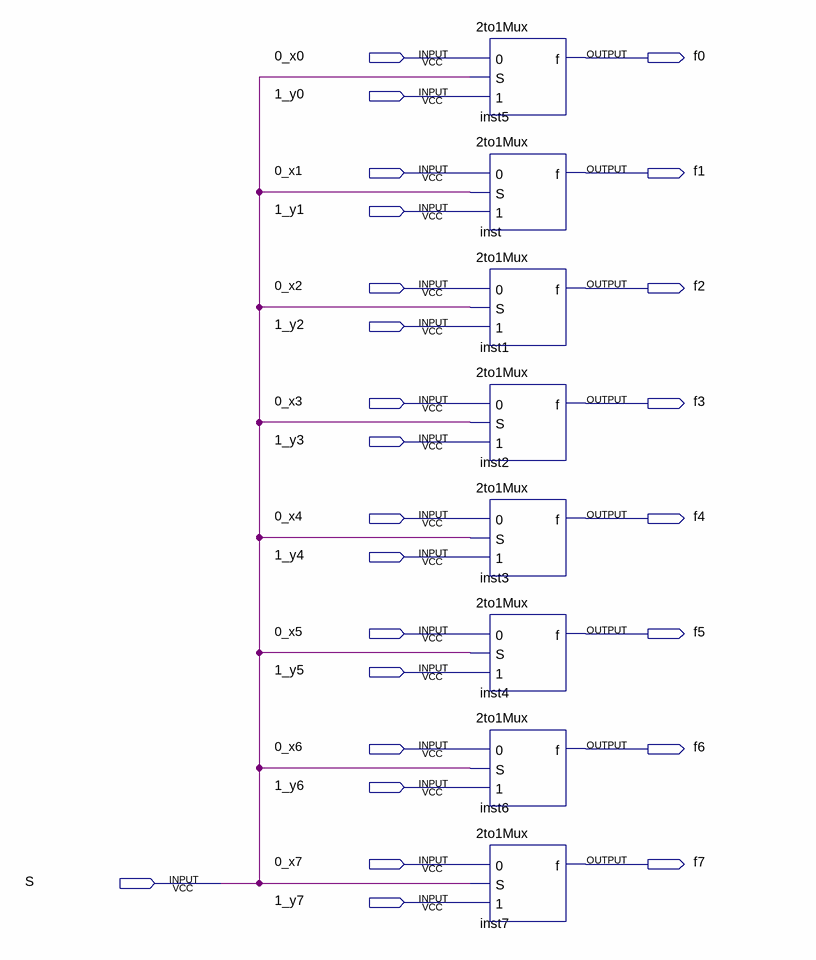
[diagram p0: schematic sheet]
// Quartus schematic 8Muxes.bdf as structural Verilog: 8 symbols, 25 pins
module \8Muxes  (
  input  \0_x0 ,
  input  \1_y0 ,
  input  \0_x1 ,
  input  \1_y1 ,
  input  \0_x2 ,
  input  \1_y2 ,
  input  \0_x3 ,
  input  \1_y3 ,
  input  \0_x4 ,
  input  \1_y4 ,
  input  \0_x5 ,
  input  \1_y5 ,
  input  \0_x6 ,
  input  \1_y6 ,
  input  \0_x7 ,
  input  S,
  input  \1_y7 ,
  output f0,
  output f1,
  output f2,
  output f3,
  output f4,
  output f5,
  output f6,
  output f7
);

  \2to1Mux  inst5 (.\0 (\0_x0 ), .S(S), .\1 (\1_y0 ), .f(f0));
  \2to1Mux  inst (.\0 (\0_x1 ), .S(S), .\1 (\1_y1 ), .f(f1));
  \2to1Mux  inst1 (.\0 (\0_x2 ), .S(S), .\1 (\1_y2 ), .f(f2));
  \2to1Mux  inst2 (.\0 (\0_x3 ), .S(S), .\1 (\1_y3 ), .f(f3));
  \2to1Mux  inst3 (.\0 (\0_x4 ), .S(S), .\1 (\1_y4 ), .f(f4));
  \2to1Mux  inst4 (.\0 (\0_x5 ), .S(S), .\1 (\1_y5 ), .f(f5));
  \2to1Mux  inst6 (.\0 (\0_x6 ), .S(S), .\1 (\1_y6 ), .f(f6));
  \2to1Mux  inst7 (.\0 (\0_x7 ), .S(S), .\1 (\1_y7 ), .f(f7));
endmodule
